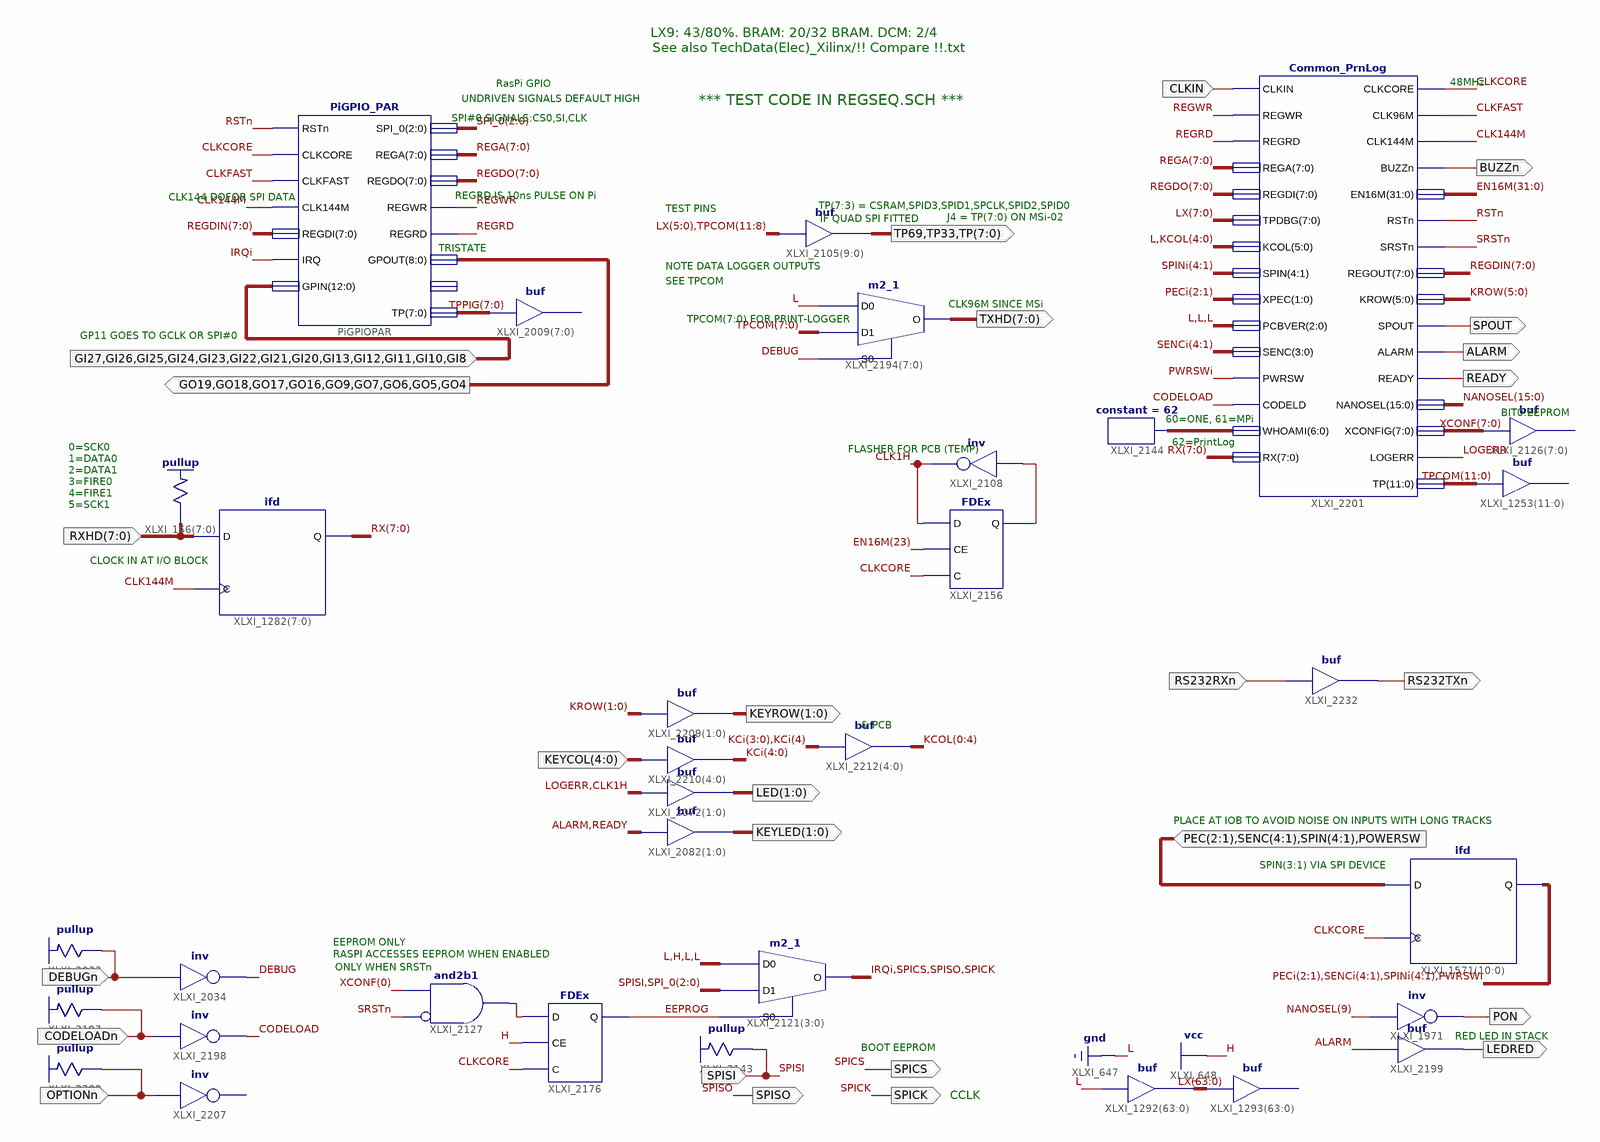
[diagram p0: schematic sheet 1]
// Xilinx ISE schematic PrintLog_MSi.sch (spartan6) as structural Verilog: 33 symbols, 26 ports
module PrintLog_MSi (
  input  [7:0] RXHD,
  input  SPISI,
  input  [2:1] PEC,
  input  [4:1] SENC,
  input  [4:1] SPIN,
  input  POWERSW,
  input  GI27,
  input  GI26,
  input  GI25,
  input  GI24,
  input  GI23,
  input  GI22,
  input  GI21,
  input  GI20,
  input  GI13,
  input  GI12,
  input  GI11,
  input  GI10,
  input  GI8,
  input  OPTIONn,
  input  DEBUGn,
  input  CODELOADn,
  input  CLKIN,
  input  [4:0] KEYCOL,
  input  RS232RXn,
  output LEDRED,
  output PON,
  output SPICK,
  output SPICS,
  output SPISO,
  output ALARM,
  output GO19,
  output GO18,
  output GO17,
  output GO16,
  output GO9,
  output GO7,
  output GO6,
  output GO5,
  output GO4,
  output TP69,
  output TP33,
  output [7:0] TP,
  output [1:0] KEYLED,
  output [7:0] TXHD,
  output BUZZn,
  output SPOUT,
  output READY,
  output [1:0] KEYROW,
  output [1:0] LED,
  output RS232TXn
);

  wire CLK1H, CLK144M, CLKCORE, CLKFAST, CODELOAD, DEBUG, EEPROG, IRQi, LOGERR, PWRSWi, REGRD, REGWR, RSTn,
       SRSTn, XLXN_184, XLXN_379;
  wire [2:0] SPI_0;
  wire [2:1] PECi;
  wire [4:0] KCi, KCOL;
  wire [4:1] SENCi, SPINi;
  wire [5:0] KROW;
  wire [6:0] XLXN_196;
  wire [7:0] REGA, REGDIN, REGDO, RX, TPPIG, XCONF;
  wire [11:0] TPCOM;
  wire [15:0] NANOSEL;
  wire [31:0] EN16M;
  wire [63:0] LX;

  \pullup  XLXI_166[7:0] (.O(RXHD));
  ifd XLXI_1282[7:0] (.C(CLK144M), .D(RXHD), .Q(RX));
  assign LX = {64{1'b0}};  // buf XLXI_1292[63..0], 64 bits wide
  // buf XLXI_1293[63..0] has open pins: I=LX, O=open
  not XLXI_1971 (PON, NANOSEL[9]);
  not XLXI_2108 (CLK1H, XLXN_184);
  FDEx XLXI_2156 (.C(CLKCORE), .CE(EN16M[23]), .D(CLK1H), .Q(XLXN_184));
  m2_1 XLXI_2121[3:0] (.D0(4'b0100), .D1({SPISI, SPI_0}), .S0(EEPROG), .O({IRQi, SPICS, SPISO, SPICK}));
  \pullup  XLXI_2143 (.O(SPISI));
  ifd XLXI_1571[10:0] (.C(CLKCORE), .D({PEC, SENC, SPIN, POWERSW}), .Q({PECi, SENCi, SPINi, PWRSWi}));
  FDEx XLXI_2176 (.C(CLKCORE), .CE(1'b1), .D(XLXN_379), .Q(EEPROG));
  and XLXI_2127 (XLXN_379, ~SRSTn, XCONF[0]);  // and2b1
  // buf XLXI_2009[7..0] has open pins: I=TPPIG, O=open
  buf XLXI_2199 (LEDRED, ALARM);
  assign {TP69, TP33, TP} = {LX[5:0], TPCOM[11:8]};  // buf XLXI_2105[9..0], 10 bits wide
  PiGPIO_PAR PiGPIOPAR (
    .CLK144M(CLK144M), .CLKCORE(CLKCORE), .CLKFAST(CLKFAST),
    .GPIN({GI27, GI26, GI25, GI24, GI23, GI22, GI21, GI20, GI13, GI12, GI11, GI10, GI8}),
    .GPOUT({GO19, GO18, GO17, GO16, GO9, GO7, GO6, GO5, GO4}), .IRQ(IRQi), .REGA(REGA), .REGDI(REGDIN),
    .REGDO(REGDO), .REGRD(REGRD), .REGWR(REGWR), .RSTn(RSTn), .SPI_0(SPI_0), .TP(TPPIG));  // open: LASTWR
  // inv XLXI_2207 has open pins: I=OPTIONn, O=open
  \pullup  XLXI_2208 (.O(OPTIONn));
  \pullup  XLXI_2033 (.O(DEBUGn));
  not XLXI_2198 (CODELOAD, CODELOADn);
  \pullup  XLXI_2197 (.O(CODELOADn));
  not XLXI_2034 (DEBUG, DEBUGn);
  m2_1 XLXI_2194[7:0] (.D0(1'b0), .D1(TPCOM[7:0]), .S0(DEBUG), .O(TXHD));
  // buf XLXI_1253[11..0] has open pins: I=TPCOM, O=open
  // buf XLXI_2126[7..0] has open pins: I=XCONF, O=open
  constant #(.CValue("62")) XLXI_2144 (.O(XLXN_196));
  Common_PrnLog XLXI_2201 (
    .ALARM(ALARM), .BUZZn(BUZZn), .CLK144M(CLK144M), .CLK96M(CLKFAST), .CLKCORE(CLKCORE), .CLKIN(CLKIN),
    .CODELD(CODELOAD), .EN16M(EN16M), .KCOL({1'b0, KCOL}), .KROW(KROW), .LOGERR(LOGERR), .NANOSEL(NANOSEL),
    .PCBVER(3'b000), .PWRSW(PWRSWi), .READY(READY), .REGA(REGA), .REGDI(REGDO), .REGOUT(REGDIN),
    .REGRD(REGRD), .REGWR(REGWR), .RSTn(RSTn), .RX(RX), .SENC(SENCi), .SPIN(SPINi), .SPOUT(SPOUT),
    .SRSTn(SRSTn), .TP(TPCOM), .TPDBG(LX[7:0]), .WHOAMI(XLXN_196), .XCONFIG(XCONF), .XPEC(PECi));
  assign {KCOL[0], KCOL[1], KCOL[2], KCOL[3], KCOL[4]} = {KCi[3:0], KCi[4]};  // buf XLXI_2212[4..0], 5 bits wide
  assign KCi = KEYCOL;  // buf XLXI_2210[4..0], 5 bits wide
  assign KEYROW = KROW[1:0];  // buf XLXI_2209[1..0], 2 bits wide
  assign KEYLED = {ALARM, READY};  // buf XLXI_2082[1..0], 2 bits wide
  assign LED = {LOGERR, CLK1H};  // buf XLXI_2072[1..0], 2 bits wide
  buf XLXI_2232 (RS232TXn, RS232RXn);

  // Notes on the sheet:
  //   LX9: 43/80%. BRAM: 20/32 BRAM. DCM: 2/4
  //   See also TechData(Elec)_Xilinx/!! Compare !!.txt
  //   48MHz
  //   RasPi GPIO
  //   UNDRIVEN SIGNALS DEFAULT HIGH
  //   *** TEST CODE IN REGSEQ.SCH ***
  //   SPI#0 SIGNALS:CS0,SI,CLK
  //   REGRD IS 10ns PULSE ON Pi
  //   CLK144 DOFOR SPI DATA
  //   TP(7:3) = CSRAM,SPID3,SPID1,SPCLK,SPID2,SPID0
  //   TEST PINS
  //   J4 = TP(7:0) ON MSi-02
  //   IF QUAD SPI FITTED
  //   TRISTATE
  //   NOTE DATA LOGGER OUTPUTS
  //   SEE TPCOM
  //   CLK96M SINCE MSi
  //   TPCOM(7:0) FOR PRINT-LOGGER
  //   GP11 GOES TO GCLK OR SPI#0
  //   BIT0:EEPROM
  //   60=ONE, 61=MPi
  //   62=PrintLog
  //   0=SCK0
  //   FLASHER FOR PCB (TEMP)
  //   1=DATA0
  //   2=DATA1
  //   3=FIRE0
  //   4=FIRE1
  //   5=SCK1
  //   CLOCK IN AT I/O BLOCK
  //   & PCB
  //   PLACE AT IOB TO AVOID NOISE ON INPUTS WITH LONG TRACKS
  //   SPIN(3:1) VIA SPI DEVICE
  //   EEPROM ONLY
  //   RASPI ACCESSES EEPROM WHEN ENABLED
  //   ONLY WHEN SRSTn
  //   RED LED IN STACK
  //   BOOT EEPROM
  //   CCLK
endmodule
